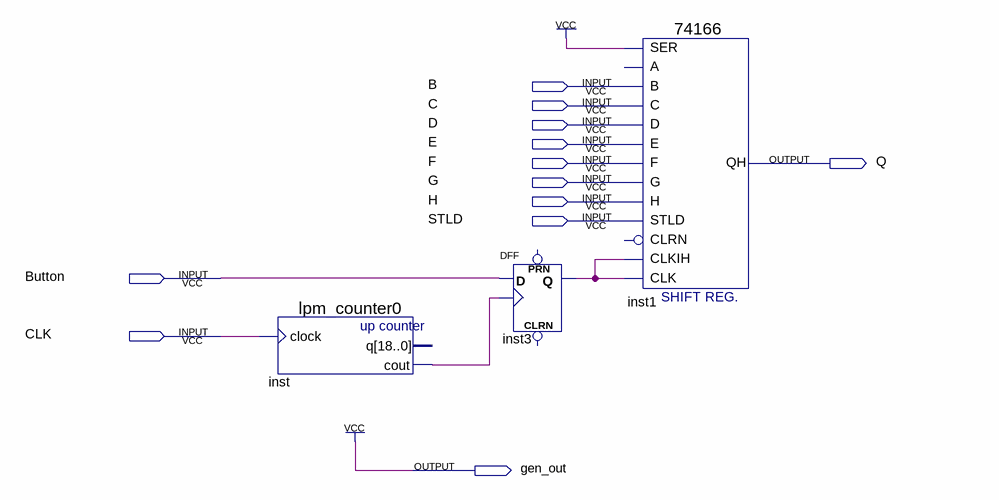
[diagram p0: schematic sheet]
// Quartus schematic 31.bdf as structural Verilog: 3 symbols, 12 pins
module \31  (
  input  B,
  input  C,
  input  D,
  input  E,
  input  F,
  input  G,
  input  H,
  input  STLD,
  input  Button,
  input  CLK,
  output Q,
  output gen_out
);

  wire inst3_q, inst_cout;

  lpm_counter0 inst (.clock(CLK), .cout(inst_cout));  // open: q
  DFF inst3 (.CLK(inst_cout), .D(Button), .Q(inst3_q));  // open: CLRN, PRN
  \74166  inst1 (
    .SER(1'b1), .C(C), .D(D), .E(E), .B(B), .STLD(STLD), .H(H), .G(G), .F(F), .CLK(inst3_q), .CLKIH(inst3_q),
    .QH(Q));  // open: A, CLRN

  assign gen_out = 1'b1;
endmodule
